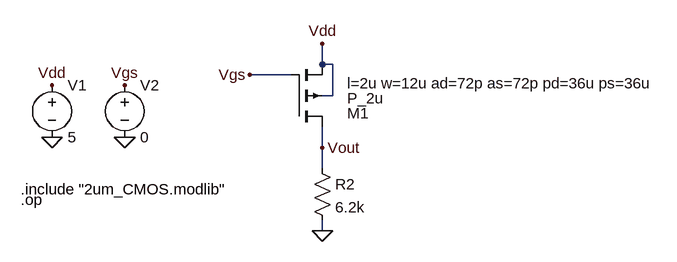
[diagram p0: schematic 2b_2c.asc]
2b_2c.asc, the LTspice schematic file:
Version 4
SHEET 1 1004 680
WIRE 208 128 208 96
WIRE 224 128 208 128
WIRE 160 144 96 144
WIRE 224 176 224 128
WIRE 224 176 208 176
WIRE 208 256 208 224
WIRE 208 288 208 256
WIRE 208 384 208 368
FLAG -96 240 0
FLAG -208 240 0
FLAG -208 160 Vdd
FLAG -96 160 Vgs
FLAG 96 144 Vgs
FLAG 208 96 Vdd
FLAG 208 384 0
FLAG 208 256 Vout
SYMBOL pmos4 160 224 M180
WINDOW 0 86 21 Left 2
WINDOW 3 86 44 Left 2
WINDOW 123 86 67 Left 2
SYMATTR InstName M1
SYMATTR Value P_2u
SYMATTR Value2 l=2u w=12u ad=72p as=72p pd=36u ps=36u
SYMBOL voltage -208 144 R0
WINDOW 123 0 0 Left 0
WINDOW 39 0 0 Left 0
SYMATTR InstName V1
SYMATTR Value 5
SYMBOL voltage -96 144 R0
WINDOW 123 0 0 Left 0
WINDOW 39 0 0 Left 0
SYMATTR InstName V2
SYMATTR Value 0
SYMBOL res 192 272 R0
SYMATTR InstName R2
SYMATTR Value 6.2k
TEXT -256 320 Left 2 !.include "2um_CMOS.modlib"
TEXT -256 336 Left 2 !.op

The netlist it stands for:
* 2b_2c.asc
M1 Vout Vgs Vdd Vdd P_2u l=2u w=12u ad=72p as=72p pd=36u ps=36u
V1 Vdd 0 5
V2 Vgs 0 0
R2 Vout 0 6.2k
.model NMOS NMOS
.model PMOS PMOS
.lib standard.mos
.include "2um_CMOS.modlib"
.op
.backanno
.end